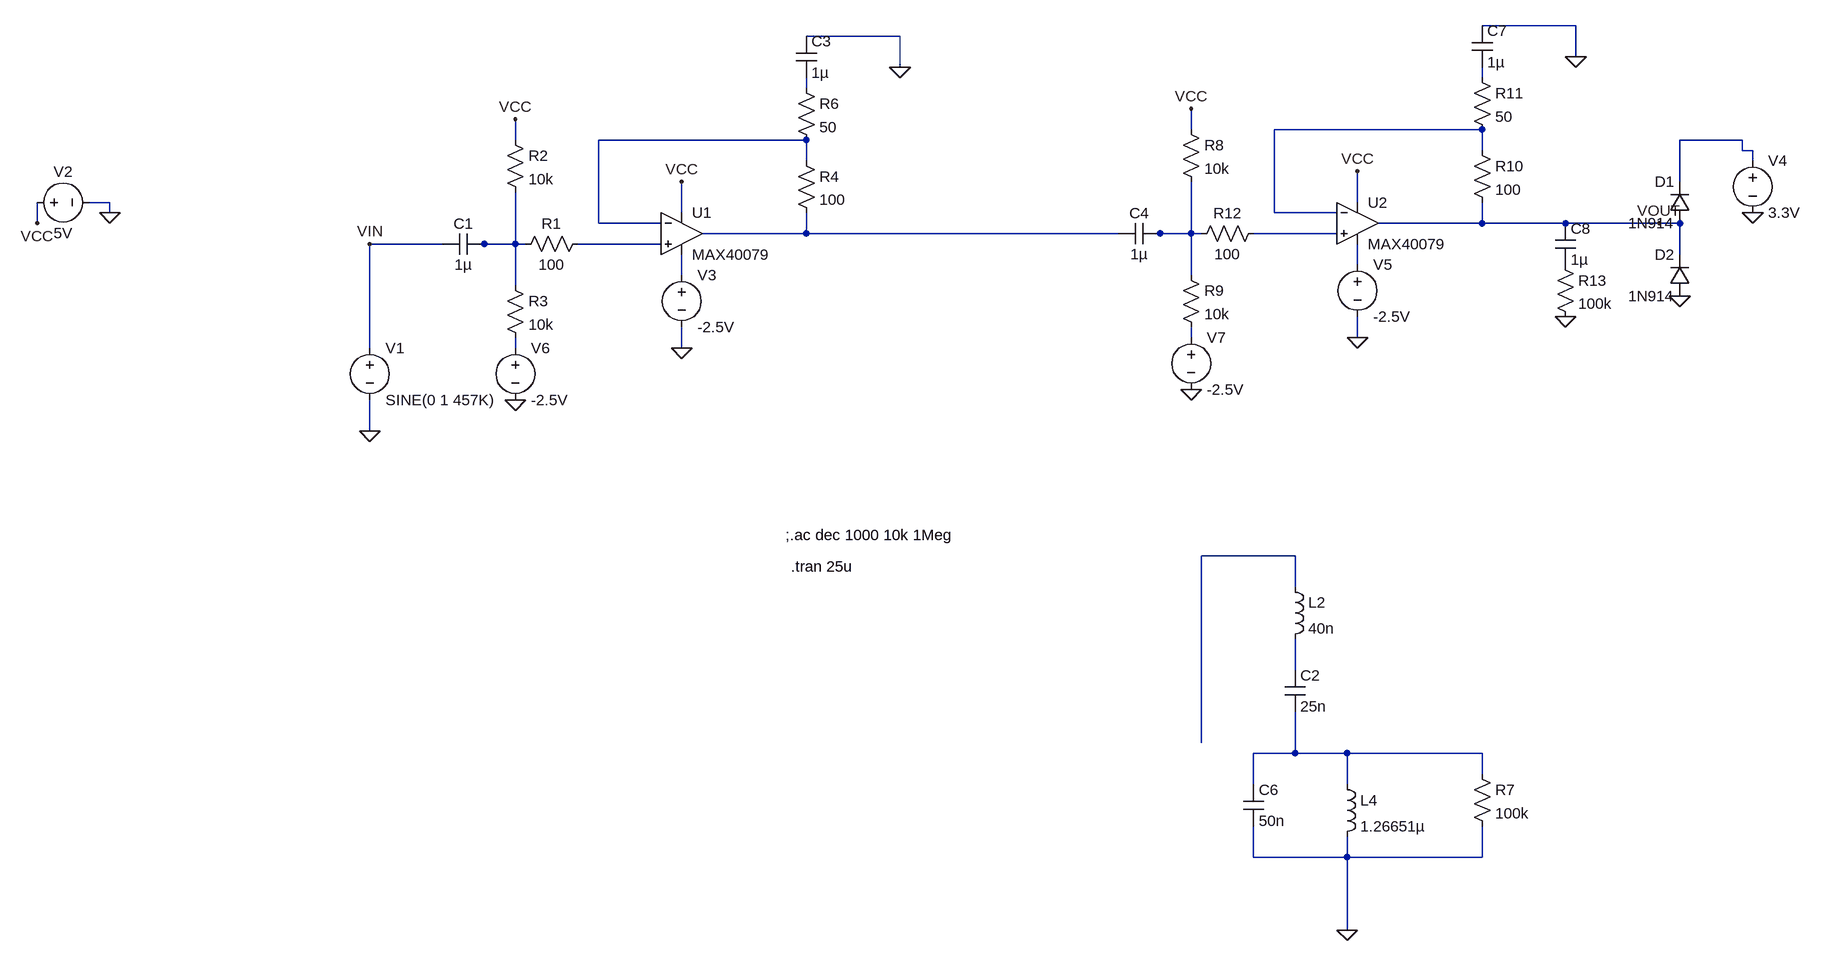
[diagram p0: schematic MAX40079_Frontend.asc]
MAX40079_Frontend.asc, the LTspice schematic file:
Version 4
SHEET 1 2160 1472
WIRE 1808 64 1664 64
WIRE 768 80 624 80
WIRE 1808 112 1808 64
WIRE 768 128 768 80
WIRE 1664 144 1664 128
WIRE 624 160 624 144
WIRE 1216 224 1216 192
WIRE 1664 224 1344 224
WIRE 176 240 176 208
WIRE 624 240 304 240
WIRE 2064 240 1968 240
WIRE 1664 256 1664 224
WIRE 2064 256 2064 240
WIRE 2080 256 2064 256
WIRE 624 272 624 240
WIRE 2080 272 2080 256
WIRE 1968 304 1968 240
WIRE -448 336 -480 336
WIRE 1472 336 1472 288
WIRE -448 352 -448 336
WIRE 432 352 432 304
WIRE 1344 352 1344 224
WIRE 1440 352 1344 352
WIRE -560 368 -560 336
WIRE 304 368 304 240
WIRE 400 368 304 368
WIRE 1664 368 1664 336
WIRE 1664 368 1504 368
WIRE 1792 368 1664 368
WIRE 1936 368 1792 368
WIRE 1968 368 1936 368
WIRE 624 384 624 352
WIRE 624 384 464 384
WIRE 1104 384 624 384
WIRE 1168 384 1152 384
WIRE 1216 384 1216 304
WIRE 1216 384 1168 384
WIRE 1232 384 1216 384
WIRE 1440 384 1312 384
WIRE 64 400 -48 400
WIRE 128 400 112 400
WIRE 176 400 176 320
WIRE 176 400 128 400
WIRE 192 400 176 400
WIRE 400 400 272 400
WIRE 1968 416 1968 368
WIRE 1472 432 1472 400
WIRE 432 448 432 416
WIRE 1216 448 1216 384
WIRE 176 464 176 400
WIRE 1216 544 1216 528
WIRE 1472 544 1472 512
WIRE -48 560 -48 400
WIRE 176 560 176 544
WIRE 432 560 432 528
WIRE -48 688 -48 640
WIRE 1376 880 1232 880
WIRE 1376 928 1376 880
WIRE 1376 1056 1376 1008
WIRE 1232 1168 1232 880
WIRE 1376 1184 1376 1120
WIRE 1376 1184 1312 1184
WIRE 1456 1184 1376 1184
WIRE 1664 1184 1456 1184
WIRE 1664 1216 1664 1184
WIRE 1312 1232 1312 1184
WIRE 1456 1232 1456 1184
WIRE 1312 1344 1312 1296
WIRE 1456 1344 1456 1312
WIRE 1456 1344 1312 1344
WIRE 1664 1344 1664 1296
WIRE 1664 1344 1456 1344
WIRE 1456 1456 1456 1344
FLAG -48 688 0
FLAG -448 352 0
FLAG -560 368 VCC
FLAG 432 304 VCC
FLAG 176 208 VCC
FLAG 768 128 0
FLAG 432 560 0
FLAG -48 400 VIN
FLAG 1456 1456 0
FLAG 176 640 0
FLAG 1472 288 VCC
FLAG 1216 192 VCC
FLAG 1808 112 0
FLAG 1472 544 0
FLAG 1936 368 VOUT
FLAG 1792 512 0
FLAG 1216 624 0
FLAG 1968 480 0
FLAG 2080 352 0
SYMBOL voltage -48 544 R0
WINDOW 123 0 0 Left 0
WINDOW 39 0 0 Left 0
SYMATTR InstName V1
SYMATTR Value SINE(0 1 457K)
SYMBOL MAX40079 432 320 R0
SYMATTR InstName U1
SYMBOL voltage -576 336 R270
WINDOW 0 32 56 VTop 2
WINDOW 3 -32 56 VBottom 2
SYMATTR InstName V2
SYMATTR Value 5V
SYMBOL Cap 128 384 R90
WINDOW 0 0 32 VBottom 2
WINDOW 3 32 32 VTop 2
SYMATTR InstName C1
SYMATTR Value 1µ
SYMBOL Res 160 224 R0
SYMATTR InstName R2
SYMATTR Value 10k
SYMBOL Res 160 448 R0
SYMATTR InstName R3
SYMATTR Value 10k
SYMBOL Res 608 256 R0
SYMATTR InstName R4
SYMATTR Value 100
SYMBOL Res 608 144 R0
SYMATTR InstName R6
SYMATTR Value 50
SYMBOL Res 288 384 R90
WINDOW 0 0 56 VBottom 2
WINDOW 3 32 56 VTop 2
SYMATTR InstName R1
SYMATTR Value 100
SYMBOL Cap 608 80 R0
SYMATTR InstName C3
SYMATTR Value 1µ
SYMBOL Voltage 432 432 R0
SYMATTR InstName V3
SYMATTR Value -2.5V
SYMBOL Ind 1360 912 R0
SYMATTR InstName L2
SYMATTR Value 40n
SYMBOL Cap 1360 1056 R0
SYMATTR InstName C2
SYMATTR Value 25n
SYMBOL Cap 1296 1232 R0
SYMATTR InstName C6
SYMATTR Value 50n
SYMBOL Ind 1440 1216 R0
SYMATTR InstName L4
SYMATTR Value 1.26651µ
SYMBOL Res 1648 1200 R0
SYMATTR InstName R7
SYMATTR Value 100k
SYMBOL MAX40079 1472 304 R0
SYMATTR InstName U2
SYMBOL Cap 1168 368 R90
WINDOW 0 0 32 VBottom 2
WINDOW 3 32 32 VTop 2
SYMATTR InstName C4
SYMATTR Value 1µ
SYMBOL Res 1200 208 R0
SYMATTR InstName R8
SYMATTR Value 10k
SYMBOL Res 1200 432 R0
SYMATTR InstName R9
SYMATTR Value 10k
SYMBOL Res 1648 240 R0
SYMATTR InstName R10
SYMATTR Value 100
SYMBOL Res 1648 128 R0
SYMATTR InstName R11
SYMATTR Value 50
SYMBOL Res 1328 368 R90
WINDOW 0 0 56 VBottom 2
WINDOW 3 32 56 VTop 2
SYMATTR InstName R12
SYMATTR Value 100
SYMBOL Cap 1648 64 R0
SYMATTR InstName C7
SYMATTR Value 1µ
SYMBOL Voltage 1472 416 R0
SYMATTR InstName V5
SYMATTR Value -2.5V
SYMBOL Cap 1776 368 R0
SYMATTR InstName C8
SYMATTR Value 1µ
SYMBOL Res 1776 416 R0
SYMATTR InstName R13
SYMATTR Value 100k
SYMBOL Voltage 176 544 R0
SYMATTR InstName V6
SYMATTR Value -2.5V
SYMBOL Voltage 1216 528 R0
SYMATTR InstName V7
SYMATTR Value -2.5V
SYMBOL diode 1984 480 R180
WINDOW 0 24 64 Left 2
WINDOW 3 24 0 Left 2
SYMATTR InstName D2
SYMATTR Value 1N914
SYMBOL diode 1984 368 R180
WINDOW 0 24 64 Left 2
WINDOW 3 24 0 Left 2
SYMATTR InstName D1
SYMATTR Value 1N914
SYMBOL Voltage 2080 256 R0
SYMATTR InstName V4
SYMATTR Value 3.3V
TEXT 592 848 Left 2 !;.ac dec 1000 10k 1Meg
TEXT 600 896 Left 2 !.tran 25u

The netlist it stands for:
* MAX40079_Frontend.asc
V1 VIN 0 SINE(0 1 457K)
* U1: MAX40079 (symbol MAX40079 not available, pins judged from their places): In+=N010 In-=N004 V+=VCC V-=N012 OUT=N006
V2 VCC 0 5V
C1 N009 VIN 1µ
R2 VCC N009 10k
R3 N009 N014 10k
R4 N004 N006 100
R6 N002 N004 50
R1 N010 N009 100
C3 0 N002 1µ
V3 N012 0 -2.5V
L2 N015 N016 40n
C2 N016 N017 25n
C6 N017 0 50n
L4 N017 0 1.26651µ
R7 N017 0 100k
* U2: MAX40079 (symbol MAX40079 not available, pins judged from their places): In+=N008 In-=N003 V+=VCC V-=N011 OUT=VOUT
C4 N007 N006 1µ
R8 VCC N007 10k
R9 N007 N013 10k
R10 N003 VOUT 100
R11 N001 N003 50
R12 N008 N007 100
C7 0 N001 1µ
V5 N011 0 -2.5V
C8 VOUT P001 1µ
R13 P001 0 100k
V6 N014 0 -2.5V
V7 N013 0 -2.5V
D2 0 VOUT 1N914
D1 VOUT N005 1N914
V4 N005 0 3.3V
.model D D
.lib standard.dio
;.ac dec 1000 10k 1Meg
.tran 25u
.backanno
.end